# Altium schematic sheet SingleBoardColumnRev2.SchDoc
size B; Date: 2/10/2009; ApprovedBy: Touraj; DrawnBy: Juan A. Nadal; Engineer: Touraj; Organization: ActiveWave; Address1: 902 Clint Moore Rd., Suite 118; Address2: Boca Raton; Address3: FL, 33487; Address4: 561-999-9422; DocumentNumber: 3; Revision: 21; SheetNumber: 3; SheetTotal: 4; PageSetup: Record=PageOptions|CenterHorizontal=True|CenterVertical=True|PrintScale=0.70|XCorrection=1.00|YCorrection=1.00|PrintKind=0|BorderSize=5000000|LeftOffset=0|BottomOffset=0|Orientation=2|PaperLength=1000|PaperWidth=1000|Scale=100|PaperSource=7|PrintQuality=-4|MediaType=1|DitherType=10|PaperKind=Letter|PrintScaleMode=1; Project: Tag105
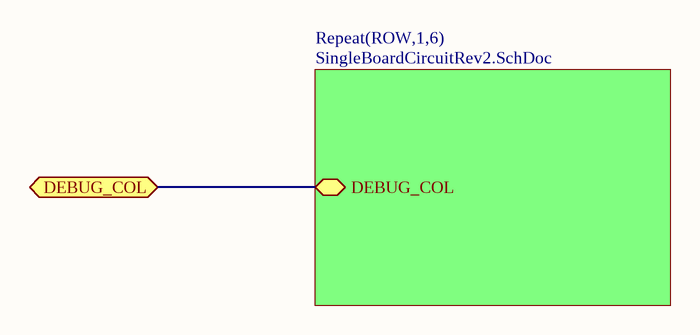
[diagram p0: SingleBoardColumnRev2.SchDoc]

## Sub-sheets
Repeat(ROW,1,6) = SingleBoardCircuitRev2.SchDoc: DEBUG_COL

## Ports
DEBUG_COL (bidir)

## Nets
DEBUG_COL: port DEBUG_COL, sheet Repeat(ROW,1,6)/DEBUG_COL

## Notes on the sheet
- APPROVALS
- DATE
- Title:
- Drawn:
- Checked:
- Release:
- Date:
- Size:
- Sheet Name:
- B
- Number:
- Time:
- Revision:
- Sheet
- of
- File: